# Altium schematic sheet 100_H&M_interface.SchDoc: H&M interface
size A4; Organization: Altium Limited; Address1: L3, 12a Rodborough Rd; Address2: Frenchs Forest; Address3: NSW; Address4: Australia 2086; DocumentNumber: 3; SheetNumber: 3; SheetTotal: 6
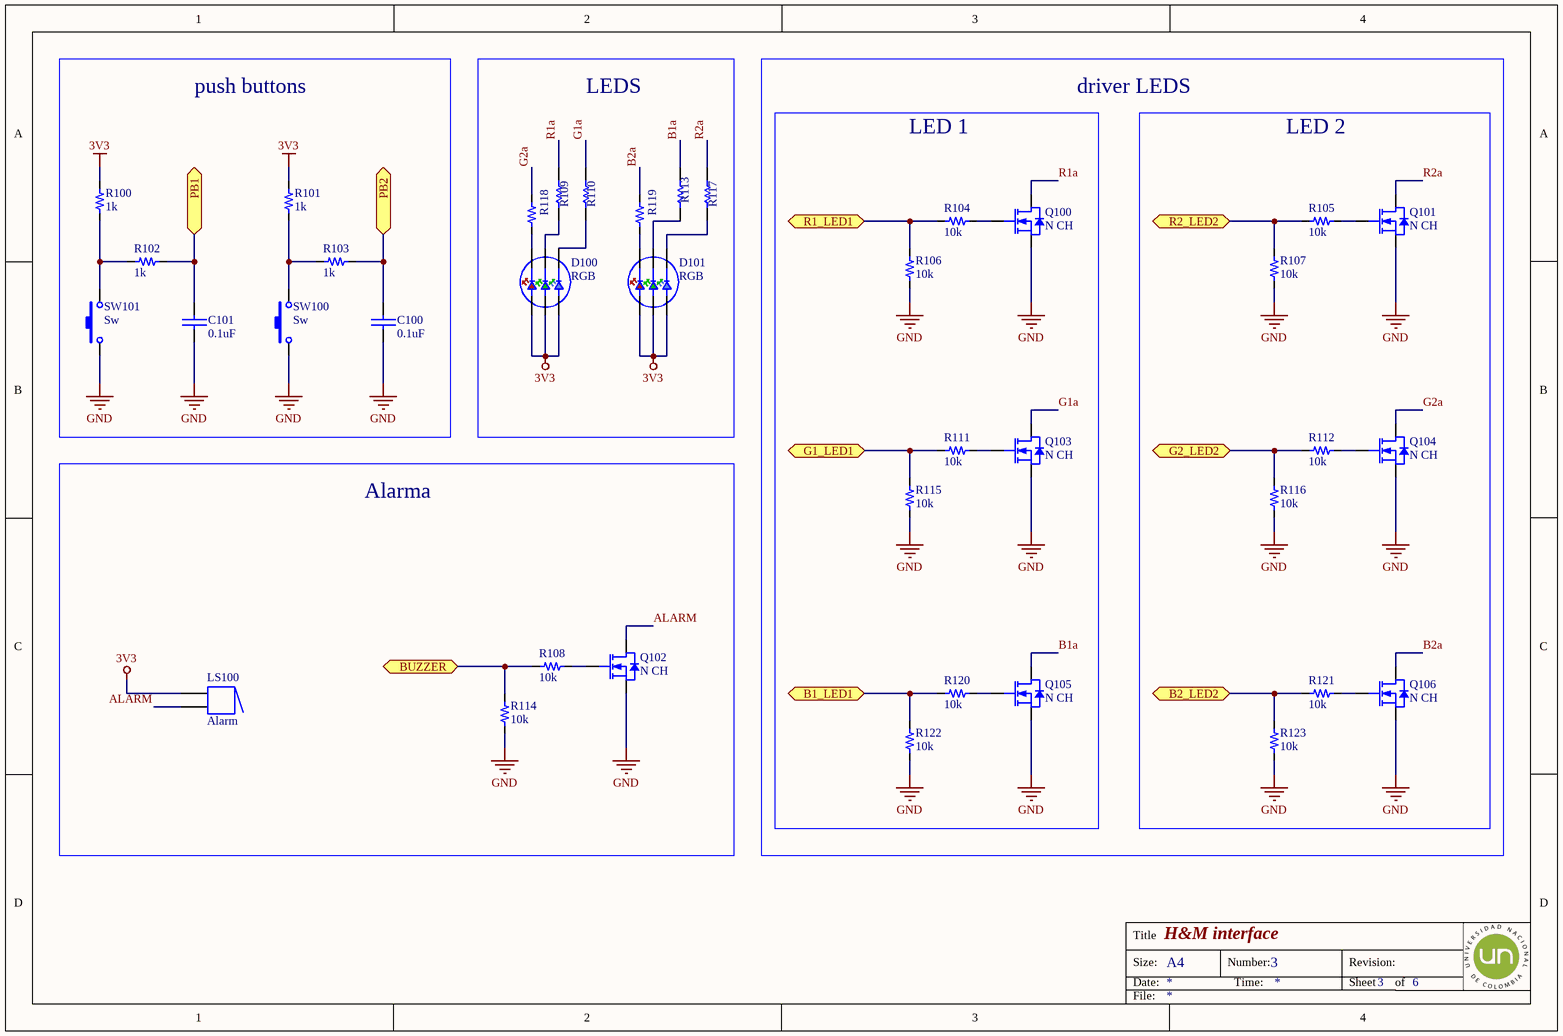
[diagram p0: 100_H&M_interface.SchDoc]

## Parts
C100  value 0.1uF  [0603_cap]  (hidden comment: 0.1uF 50V)
C101  value 0.1uF  [0603_cap]  (hidden comment: 0.1uF 50V)
D100  RGB  [RGB_NS_3.5X3.7]
D101  RGB  [RGB_NS_3.5X3.7]
LS100  Alarm  [Alarm]
Q100  N CH  [SOT_23_3]
Q101  N CH  [SOT_23_3]
Q102  N CH  [SOT_23_3]
Q103  N CH  [SOT_23_3]
Q104  N CH  [SOT_23_3]
Q105  N CH  [SOT_23_3]
Q106  N CH  [SOT_23_3]
R100  value 1k  [0603_res]  (hidden comment: 1k 1/10W)
R101  value 1k  [0603_res]  (hidden comment: 1k 1/10W)
R102  value 1k  [0603_res]  (hidden comment: 1k 1/10W)
R103  value 1k  [0603_res]  (hidden comment: 1k 1/10W)
R104  value 10k  [0603_res]  (hidden comment: 10k 1/10W)
R105  value 10k  [0603_res]  (hidden comment: 10k 1/10W)
R106  value 10k  [0603_res]  (hidden comment: 10k 1/10W)
R107  value 10k  [0603_res]  (hidden comment: 10k 1/10W)
R108  value 10k  [0603_res]  (hidden comment: 10k 1/10W)
R109  330R 1/10W  [0603_res]  (value not drawn)
R110  330R 1/10W  [0603_res]  (value not drawn)
R111  value 10k  [0603_res]  (hidden comment: 10k 1/10W)
R112  value 10k  [0603_res]  (hidden comment: 10k 1/10W)
R113  330R 1/10W  [0603_res]  (value not drawn)
R114  value 10k  [0603_res]  (hidden comment: 10k 1/10W)
R115  value 10k  [0603_res]  (hidden comment: 10k 1/10W)
R116  value 10k  [0603_res]  (hidden comment: 10k 1/10W)
R117  330R 1/10W  [0603_res]  (value not drawn)
R118  330R 1/10W  [0603_res]  (value not drawn)
R119  330R 1/10W  [0603_res]  (value not drawn)
R120  value 10k  [0603_res]  (hidden comment: 10k 1/10W)
R121  value 10k  [0603_res]  (hidden comment: 10k 1/10W)
R122  value 10k  [0603_res]  (hidden comment: 10k 1/10W)
R123  value 10k  [0603_res]  (hidden comment: 10k 1/10W)
SW100  Sw  [Sw_PUSH_4.5x4.5x5mm]
SW101  Sw  [Sw_PUSH_4.5x4.5x5mm]

## Blocks framed on the sheet
push buttons: C100 C101 R100-R103 SW100 SW101
LEDS: D100 D101 R109 R110 R113 R117-R119
LED 2: Q101 Q104 Q106 R105 R107 R112 R116 R121 R123
Alarma: LS100 Q102 R108 R114

## Ports
B1_LED1 (bidir, see MAIN[2C], 300_MCU[3B]), B2_LED2 (bidir, see MAIN[2C], 300_MCU[3B]), BUZZER (bidir, see MAIN[2C], 300_MCU[3A]), G1_LED1 (bidir, see MAIN[2C], 300_MCU[3B]), G2_LED2 (bidir, see MAIN[2C], 300_MCU[3B]), PB1 (bidir, see MAIN[2C], 300_MCU[3B]), PB2 (bidir, see MAIN[2C], 300_MCU[3B]), R1_LED1 (bidir, see MAIN[2C], 300_MCU[3B]), R2_LED2 (bidir, see MAIN[2C], 300_MCU[3B])

## Nets
3V3: D100.4 D100.5 D100.6 D101.4 D101.5 D101.6 LS100.0 R100.2 R101.2
GND: C100.1 C101.1 Q100.2(S) Q101.2(S) Q102.2(S) Q103.2(S) Q104.2(S) Q105.2(S) Q106.2(S) R106.1 R107.1 R114.1 R115.1 R116.1 R122.1 R123.1 SW100.1 SW101.1
ALARM: LS100.1(2A) Q102.3(D)
B1_LED1: R120.1 R122.2 ; port B1_LED1
B1a: Q105.3(D) R113.2
B2_LED2: R121.1 R123.2 ; port B2_LED2
B2a: Q106.3(D) R119.2
BUZZER: R108.1 R114.2 ; port BUZZER
G1_LED1: R111.1 R115.2 ; port G1_LED1
G1a: Q103.3(D) R110.2
G2_LED2: R112.1 R116.2 ; port G2_LED2
G2a: Q104.3(D) R118.2
PB1: C101.2 R102.1 ; port PB1
PB2: C100.2 R103.1 ; port PB2
R1_LED1: R104.1 R106.2 ; port R1_LED1
R1a: Q100.3(D) R109.2
R2_LED2: R105.1 R107.2 ; port R2_LED2
R2a: Q101.3(D) R117.2
NetD100_1: D100.1 R110.1
NetD100_2: D100.2 R109.1
NetD100_3: D100.3 R118.1
NetD101_1: D101.1 R117.1
NetD101_2: D101.2 R113.1
NetD101_3: D101.3 R119.1
NetQ100_1: Q100.1(G) R104.2
NetQ101_1: Q101.1(G) R105.2
NetQ102_1: Q102.1(G) R108.2
NetQ103_1: Q103.1(G) R111.2
NetQ104_1: Q104.1(G) R112.2
NetQ105_1: Q105.1(G) R120.2
NetQ106_1: Q106.1(G) R121.2
NetR100_1: R100.1 R102.2 SW101.2
NetR101_1: R101.1 R103.2 SW100.2

## Notes on the sheet
- driver LEDS
- LED 1
- Title
- Size:
- Date:
- A4
- Number:
- Time:
- Revision:
- Sheet
- of
- File:

## Library data of the parts
C100 C101 = Cap_0.1uF_0603_50V: 50V 100nF Y5V -20%~+80% 0603 Multilayer Ceramic Capacitors MLCC - SMD/SMT ROHS; Manufacturer: Walsin Tech Corp; Manufacturer Part Number: 0603F104Z500CT; Supplier 1: LCSC; Supplier Part Number 1: C83060; ComponentLink1Description: LCSC; ComponentLink1URL: https://www.lcsc.com/product-detail/Multilayer-Ceramic-Capacitors-MLCC-SMD-SMT_Walsin-Tech-Corp-0603F104Z500CT_C83060.html
D100 D101 = LED_RGB_3535_SMD: -30℃~+85℃ RGB 110° 3535(mm) Light Emitting Diodes (LED) ROHS; Manufacturer: Foshan NationStar Optoelectronics; Manufacturer Part Number: RS-3535MWAM; Supplier 1: LCSC; Supplier Part Number 1: C842778; ComponentLink1Description: LCSC; ComponentLink1URL: https://www.lcsc.com/product-detail/Light-Emitting-Diodes-LED_Foshan-NationStar-Optoelectronics-RS-3535MWAM_C842778.html
LS100 = Alarm: Buzzers Indicator, Internally Driven Piezo 12 V 300mA 2.5kHz 100dB @ 12V, 100cm Panel Mount, Flange Wire Leads; Manufacture: Mallory Sonalert Products Inc.; Manufacture Part Number: PS-583Q; Usage: Trough hole; Supplier: Digi-key; Supplier Part Number: PS-583Q-ND; ComponentLink1Description: Datasheet; ComponentLink1URL: https://www.digikey.com/en/products/detail/mallory-sonalert-products-inc/PS-583Q/1957914?s=N4IgTCBcDaIAoGUC0BWAHAZgIogLoF8g
Q100-Q106 = Q_NFET_20V_3.2A_SOT23: MOSFET N-CH 20V SOT23; Manufacturer: Doeshare; Manufacturer Part Number: DN2302S; Supplier 1: LCSC; Supplier Part Number 1: C2931750; ComponentLink1Description: LCSC; ComponentLink1URL: https://www.lcsc.com/product-detail/MOSFETs_Doeshare-DN2302S_C2931750.html
R100-R103 = Res_1k_0603_1/10W: RES SMD 1k OHM 5% 1/10W 0603; Manufacturer: FOJAN; Manufacturer Part Number: FRC0603J102 TS; ComponentLink1URL: https://www.lcsc.com/product-detail/Chip-Resistor-Surface-Mount_FOJAN-FRC0603J102-TS_C2907113.html; Supplier 1: LCSC; Supplier Part Number 1: C2907113; ComponentLink1Description: LCSC
R104-R108 R111 R112 R114-R116 R120-R123 = Res_10k_0603_1/10W: RES SMD 10k OHM 5% 1/10W 0603; Manufacturer: FOJAN; Manufacturer Part Number: FRC0603J103TS; ComponentLink1URL: https://www.lcsc.com/product-detail/Chip-Resistor-Surface-Mount_FOJAN-FRC0603J103TS_C2930027.html; Supplier 1: LCSC; Supplier Part Number 1: C2930027; ComponentLink1Description: LCSC
R109 R110 R113 R117 = RES_130R_0603: 100mW Thin Film Resistor ±0.1% 130Ω 0603 Chip Resistor - Surface Mount ROHS; Manufacture: resistor today; Manufacture Part Number: PTFR0603B130RP9; Suplier Part Number: C351683; Usage: 0603; Supplier: lcsc; ComponentLink1Description: LCSC; ComponentLink1URL: https://www.lcsc.com/product-detail/Chip-span-style-background-color-ff0-Resistor-span-Surface-Mount_span-style-background-color-ff0-Resistor-span-Today-PTFR0603B130RP9_C351683.html
R118 R119 = Res_100R_0603_1/10W: RES SMD 100R OHM 5% 1/10W 0603; Manufacturer: FOJAN; Manufacturer Part Number: FRC0603J101 TS; ComponentLink1URL: https://www.lcsc.com/product-detail/Chip-Resistor-Surface-Mount_FOJAN-FRC0603J101-TS_C2907089.html; Supplier 1: LCSC; Supplier Part Number 1: C2907089; ComponentLink1Description: LCSC; Value: 100R
SW100 SW101 = Sw_PUSH_4.5x4.5x5.0xmm: SWITCH TACTILE SPST-NO 0.05A 12V; Manufacturer: BZCN; Manufacturer Part Number: TSC015A05026A; Supplier 1: LCSC; Supplier Part Number 1: C2888509; Last modified by: N-A.Potosi; Last modified date: 20190222; ComponentLink1Description: LCSC; ComponentLink1URL: https://www.lcsc.com/product-detail/Tactile-Switches_BZCN-TSC015A05026A_C2888509.html